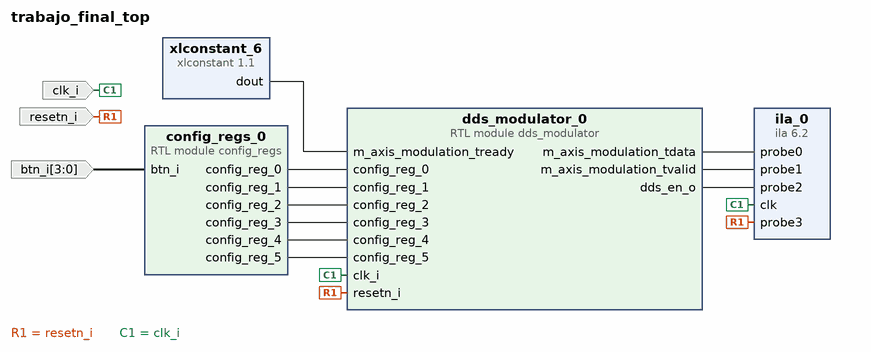
[diagram p0: block diagram of the top level]
# Vivado block design trabajo_final_top, xc7z010clg400-1, Vivado 2019.2
create_bd_design trabajo_final_top

create_bd_port -dir I resetn_i
create_bd_port -dir I -type clk clk_i
set_property -dict {CONFIG.FREQ_HZ 125000000} [get_bd_ports clk_i]
create_bd_port -dir I -from 3 -to 0 btn_i

create_bd_cell -type ip -vlnv xilinx.com:ip:ila:6.2 ila_0
set_property -dict [list \
  CONFIG.C_DATA_DEPTH 16384 \
  CONFIG.C_ENABLE_ILA_AXI_MON false \
  CONFIG.C_MONITOR_TYPE Native \
  CONFIG.C_NUM_OF_PROBES 4 \
  CONFIG.C_PROBE0_WIDTH 72 \
  CONFIG.C_SLOT_0_AXI_PROTOCOL AXI4S \
] [get_bd_cells ila_0]
create_bd_cell -type ip -vlnv xilinx.com:ip:xlconstant:1.1 xlconstant_6
create_bd_cell -type module -reference dds_modulator dds_modulator_0
create_bd_cell -type module -reference config_regs config_regs_0

# ---- connections ----

connect_bd_net [get_bd_pins dds_modulator_0/m_axis_modulation_tdata] [get_bd_pins ila_0/probe0]
connect_bd_net [get_bd_pins dds_modulator_0/m_axis_modulation_tvalid] [get_bd_pins ila_0/probe1]
connect_bd_net [get_bd_pins dds_modulator_0/dds_en_o] [get_bd_pins ila_0/probe2]
connect_bd_net -net resetn_i_0_1 [get_bd_ports resetn_i] [get_bd_pins ila_0/probe3] [get_bd_pins dds_modulator_0/resetn_i]
connect_bd_net [get_bd_ports clk_i] [get_bd_pins ila_0/clk] [get_bd_pins dds_modulator_0/clk_i]
connect_bd_net [get_bd_pins xlconstant_6/dout] [get_bd_pins dds_modulator_0/m_axis_modulation_tready]
connect_bd_net [get_bd_pins config_regs_0/config_reg_0] [get_bd_pins dds_modulator_0/config_reg_0]
connect_bd_net [get_bd_pins config_regs_0/config_reg_1] [get_bd_pins dds_modulator_0/config_reg_1]
connect_bd_net [get_bd_pins config_regs_0/config_reg_2] [get_bd_pins dds_modulator_0/config_reg_2]
connect_bd_net [get_bd_pins config_regs_0/config_reg_3] [get_bd_pins dds_modulator_0/config_reg_3]
connect_bd_net [get_bd_pins config_regs_0/config_reg_4] [get_bd_pins dds_modulator_0/config_reg_4]
connect_bd_net [get_bd_pins config_regs_0/config_reg_5] [get_bd_pins dds_modulator_0/config_reg_5]
connect_bd_net [get_bd_ports btn_i] [get_bd_pins config_regs_0/btn_i]

validate_bd_design
save_bd_design
